# EAGLE schematic 2023-04-01 LN2 Autofill Connectors - Copy (EAGLE 9.6.2)
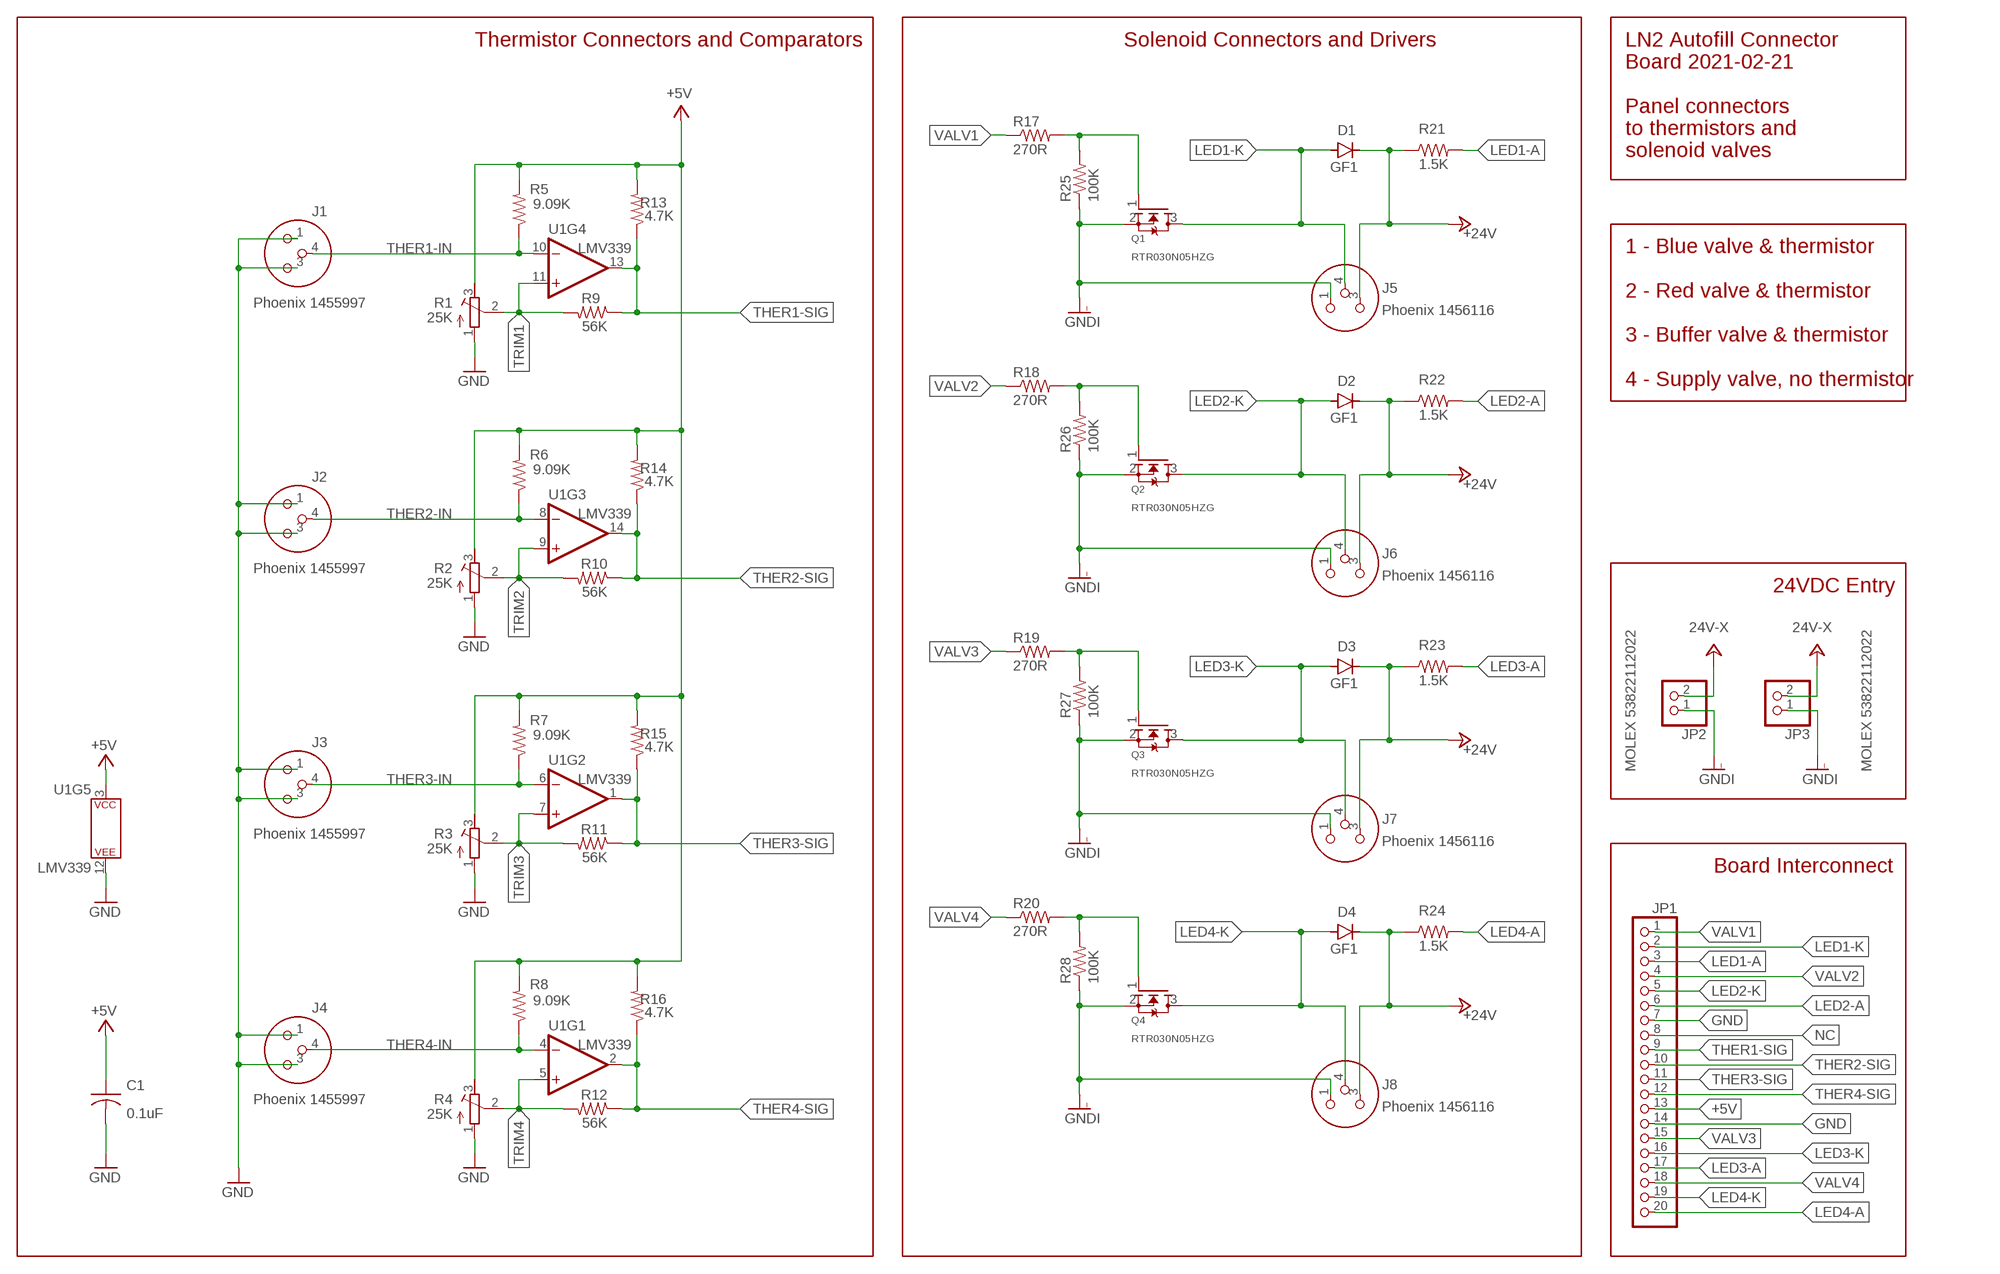
[diagram p0: schematic, sheet 1]

## Parts
C1  0.1uF  C-USC0805  [C0805]
D1  GF1  [SMA-DO214AC]
D2  GF1  [SMA-DO214AC]
D3  GF1  [SMA-DO214AC]
D4  GF1  [SMA-DO214AC]
J1  Phoenix 1455997  PHOENIX-3PIN-MALE  [PHOENIX-3PIN]
J2  Phoenix 1455997  PHOENIX-3PIN-MALE  [PHOENIX-3PIN]
J3  Phoenix 1455997  PHOENIX-3PIN-MALE  [PHOENIX-3PIN]
J4  Phoenix 1455997  PHOENIX-3PIN-MALE  [PHOENIX-3PIN]
J5  Phoenix 1456116  PHOENIX-3PIN-FEMALE  [PHOENIX-3PIN-FEMALE]
J6  Phoenix 1456116  PHOENIX-3PIN-FEMALE  [PHOENIX-3PIN-FEMALE]
J7  Phoenix 1456116  PHOENIX-3PIN-FEMALE  [PHOENIX-3PIN-FEMALE]
J8  Phoenix 1456116  PHOENIX-3PIN-FEMALE  [PHOENIX-3PIN-FEMALE]
JP1  PINHD-1X20  [1X20]
JP2  MOLEX 53822112022  PINHD-1X2MOLEX-02-VERT  [MOLEX-02-VERT]
JP3  MOLEX 53822112022  PINHD-1X2MOLEX-02-VERT  [MOLEX-02-VERT]
Q1  RTR030N05HZG  MOSFET-NREFLOW  [SOT23]
Q2  RTR030N05HZG  MOSFET-NREFLOW  [SOT23]
Q3  RTR030N05HZG  MOSFET-NREFLOW  [SOT23]
Q4  RTR030N05HZG  MOSFET-NREFLOW  [SOT23]
R1  25K  R-TRIMM3296Y  [RTRIM3296Y]
R2  25K  R-TRIMM3296Y  [RTRIM3296Y]
R3  25K  R-TRIMM3296Y  [RTRIM3296Y]
R4  25K  R-TRIMM3296Y  [RTRIM3296Y]
R5  9.09K  R-US_R0805  [R0805]
R6  9.09K  R-US_R0805  [R0805]
R7  9.09K  R-US_R0805  [R0805]
R8  9.09K  R-US_R0805  [R0805]
R9  56K  R-US_R0805  [R0805]
R10  56K  R-US_R0805  [R0805]
R11  56K  R-US_R0805  [R0805]
R12  56K  R-US_R0805  [R0805]
R13  4.7K  R-US_R0805  [R0805]
R14  4.7K  R-US_R0805  [R0805]
R15  4.7K  R-US_R0805  [R0805]
R16  4.7K  R-US_R0805  [R0805]
R17  270R  R-US_R0805  [R0805]
R18  270R  R-US_R0805  [R0805]
R19  270R  R-US_R0805  [R0805]
R20  270R  R-US_R0805  [R0805]
R21  1.5K  R-US_R0805  [R0805]
R22  1.5K  R-US_R0805  [R0805]
R23  1.5K  R-US_R0805  [R0805]
R24  1.5K  R-US_R0805  [R0805]
R25  100K  R-US_R0805  [R0805]
R26  100K  R-US_R0805  [R0805]
R27  100K  R-US_R0805  [R0805]
R28  100K  R-US_R0805  [R0805]
U1  LMV339  LM339SOIC-14  [SOIC127P599X175-14]

## Nets
+5V: C1.1 JP1.13 R1.3(E) R2.3(E) R3.3(E) R4.3(E) R5.2 R6.2 R7.2 R8.2 R13.2 R14.2 R15.2 R16.2 U1.3(P$V+)
+24V: D1.K(C) D2.K(C) D3.K(C) D4.K(C) J5.3 J6.3 J7.3 J8.3 JP2.2 JP3.2 R21.1 R22.1 R23.1 R24.1 ; supply symbol labelled 24V-X
GND: C1.2 J1.1 J1.3 J2.1 J2.3 J3.1 J3.3 J4.1 J4.3 JP1.7 JP1.14 R1.1(A) R2.1(A) R3.1(A) R4.1(A) U1.12(P$V-)
GNDI: J5.1 J6.1 J7.1 J8.1 JP2.1 JP3.1 Q1.2(S) Q2.2(S) Q3.2(S) Q4.2(S) R25.1 R26.1 R27.1 R28.1
LED1-A: JP1.3 R21.2
LED1-K: D1.A J5.4 JP1.2 Q1.3(D)
LED2-A: JP1.6 R22.2
LED2-K: D2.A J6.4 JP1.5 Q2.3(D)
LED3-A: JP1.17 R23.2
LED3-K: D3.A J7.4 JP1.16 Q3.3(D)
LED4-A: JP1.20 R24.2
LED4-K: D4.A J8.4 JP1.19 Q4.3(D)
N$1: Q1.1(G) R17.2 R25.2
N$2: Q2.1(G) R18.2 R26.2
N$3: Q3.1(G) R19.2 R27.2
N$4: Q4.1(G) R20.2 R28.2
NC: JP1.8
THER1-IN: J1.4 R5.1 U1.10(-IN)
THER1-SIG: JP1.9 R9.1 R13.1 U1.13(OUT)
THER2-IN: J2.4 R6.1 U1.8(-IN)
THER2-SIG: JP1.10 R10.1 R14.1 U1.14(OUT)
THER3-IN: J3.4 R7.1 U1.6(-IN)
THER3-SIG: JP1.11 R11.1 R15.1 U1.1(OUT)
THER4-IN: J4.4 R8.1 U1.4(-IN)
THER4-SIG: JP1.12 R12.1 R16.1 U1.2(OUT)
TRIM1: R1.2(S) R9.2 U1.11(+IN)
TRIM2: R2.2(S) R10.2 U1.9(+IN)
TRIM3: R3.2(S) R11.2 U1.7(+IN)
TRIM4: R4.2(S) R12.2 U1.5(+IN)
VALV1: JP1.1 R17.1
VALV2: JP1.4 R18.1
VALV3: JP1.15 R19.1
VALV4: JP1.18 R20.1

## Notes on the sheet
- Thermistor Connectors and Comparators | Solenoid Connectors and Drivers
- LN2 Autofill Connector
  Board 2021-02-21
  
  Panel connectors
  to thermistors and
  solenoid valves
- 1 - Blue valve & thermistor
  
  2 - Red valve & thermistor
  
  3 - Buffer valve & thermistor
  
  4 - Supply valve, no thermistor
- 24VDC Entry
- Board Interconnect

## Library data of the parts
C1 = AUmlib:C-US: CAPACITOR, American symbol; SPICEPREFIX: C
D1-D4 = AUmlib:GF1: DIODE
J1-J4 = AUmlib:PHOENIX-3PIN-MALE
J5-J8 = AUmlib:PHOENIX-3PIN-FEMALE: Phoenix Contact 3-pin circular M8 female PCB 1456116
JP1 = AUmlib:PINHD-1X20: PIN HEADER
JP2 JP3 = AUmlib:PINHD-1X2: PIN HEADER
Q1-Q4 = AUmlib:MOSFET-N: N-Channel Mosfet 2N7002E - 60V 260mA SOT23 [Digikey: 2N7002ET1GOSTR-ND] - REEL BSH103 - 30V 850mA SOT23 [Digikey: 568-5013-1-ND]
R1-R4 = AUmlib:R-TRIMM: Trimm resistor; SPICEMODEL: X; SPICEPREFIXL: POT
R5-R28 = AUmlib:R-US_: RESISTOR, American symbol; SPICEPREFIX: R
U1 = AUmlib:LM339: Quad Comparator - LM339PWR Based on information from the SLCS006N datasheet from TI (www.ti.com). Created by nick@scantool.net, 2008. Updated 2016. SparkFun Products SparkFun OBD-II UART <https://www.sparkfun.com/products/9555> (WIG-09555) SparkFun Car Diagnostics Kit <https://www.sparkfun.com/products/10769> (RTL-10769)